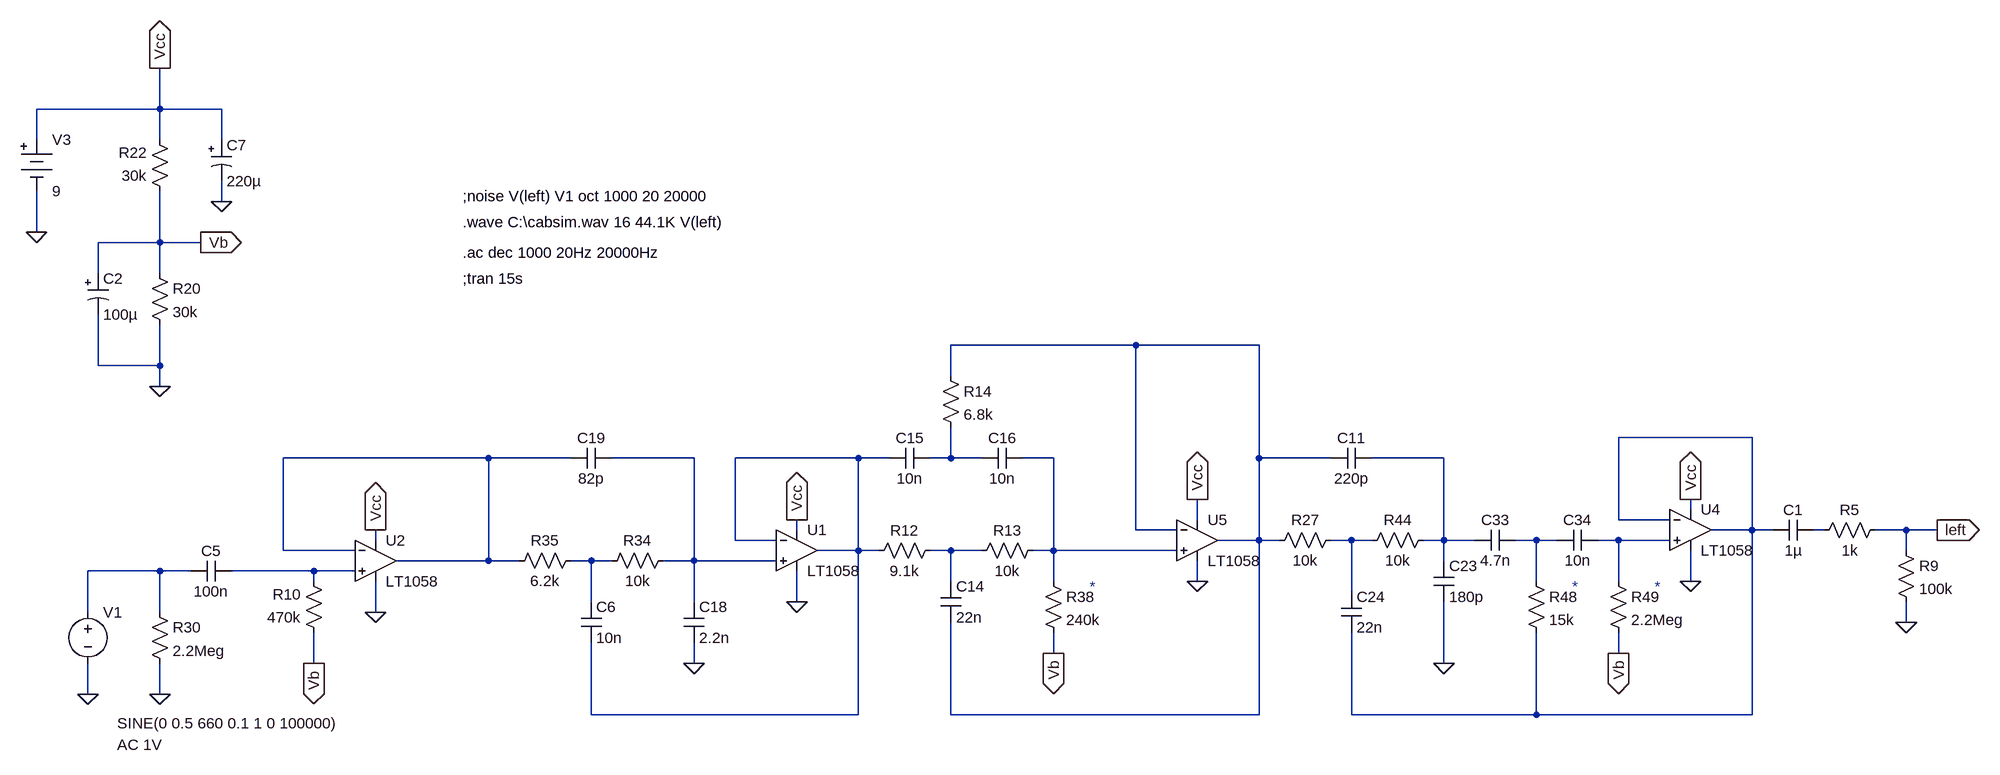
[diagram p0: schematic 4x12 V30 Cabinet Simulator lownoise.asc]
4x12 V30 Cabinet Simulator lownoise.asc, the LTspice schematic file:
Version 4
SHEET 1 2020 1684
WIRE -3840 -544 -3840 -608
WIRE -3840 -544 -4032 -544
WIRE -3744 -544 -3840 -544
WIRE -4032 -496 -4032 -544
WIRE -3840 -496 -3840 -544
WIRE -3744 -496 -3744 -544
WIRE -3744 -400 -3744 -432
WIRE -4032 -352 -4032 -416
WIRE -3840 -336 -3840 -416
WIRE -3840 -336 -3936 -336
WIRE -3776 -336 -3840 -336
WIRE -3936 -288 -3936 -336
WIRE -3840 -288 -3840 -336
WIRE -2320 -176 -2608 -176
WIRE -2128 -176 -2320 -176
WIRE -3936 -144 -3936 -224
WIRE -3840 -144 -3840 -208
WIRE -3840 -144 -3936 -144
WIRE -2608 -128 -2608 -176
WIRE -3840 -112 -3840 -144
WIRE -1360 -32 -1568 -32
WIRE -3328 0 -3648 0
WIRE -3200 0 -3328 0
WIRE -3008 0 -3136 0
WIRE -2752 0 -2944 0
WIRE -2704 0 -2752 0
WIRE -2608 0 -2608 -48
WIRE -2608 0 -2640 0
WIRE -2560 0 -2608 0
WIRE -2448 0 -2496 0
WIRE -2128 0 -2128 -176
WIRE -2016 0 -2128 0
WIRE -1840 0 -1952 0
WIRE -1456 80 -1456 64
WIRE -2224 96 -2224 64
WIRE -1568 96 -1568 -32
WIRE -1488 96 -1568 96
WIRE -2848 112 -2848 96
WIRE -2320 112 -2320 -176
WIRE -2256 112 -2320 112
WIRE -1360 112 -1360 -32
WIRE -1360 112 -1424 112
WIRE -1328 112 -1360 112
WIRE -1248 112 -1264 112
WIRE -1120 112 -1168 112
WIRE -1072 112 -1120 112
WIRE -3504 128 -3504 112
WIRE -2944 128 -2944 0
WIRE -2880 128 -2944 128
WIRE -2128 128 -2128 0
WIRE -2128 128 -2192 128
WIRE -2096 128 -2128 128
WIRE -1984 128 -2016 128
WIRE -1952 128 -1984 128
WIRE -1840 128 -1840 0
WIRE -1840 128 -1872 128
WIRE -1792 128 -1840 128
WIRE -1696 128 -1728 128
WIRE -1664 128 -1696 128
WIRE -1568 128 -1600 128
WIRE -1488 128 -1568 128
WIRE -3648 144 -3648 0
WIRE -3536 144 -3648 144
WIRE -2752 144 -2752 0
WIRE -2752 144 -2816 144
WIRE -2720 144 -2752 144
WIRE -2608 144 -2640 144
WIRE -2560 144 -2608 144
WIRE -2448 144 -2448 0
WIRE -2448 144 -2480 144
WIRE -2256 144 -2448 144
WIRE -1120 144 -1120 112
WIRE -3328 160 -3328 0
WIRE -3328 160 -3472 160
WIRE -3280 160 -3328 160
WIRE -3168 160 -3200 160
WIRE -3136 160 -3168 160
WIRE -3008 160 -3008 0
WIRE -3008 160 -3056 160
WIRE -2880 160 -3008 160
WIRE -1840 160 -1840 128
WIRE -3840 176 -3952 176
WIRE -3792 176 -3840 176
WIRE -3600 176 -3728 176
WIRE -3536 176 -3600 176
WIRE -3600 192 -3600 176
WIRE -2608 192 -2608 144
WIRE -2448 192 -2448 144
WIRE -2224 192 -2224 160
WIRE -1696 192 -1696 128
WIRE -1568 192 -1568 128
WIRE -1456 192 -1456 144
WIRE -1984 208 -1984 128
WIRE -3168 224 -3168 160
WIRE -3008 224 -3008 160
WIRE -2848 224 -2848 176
WIRE -3952 240 -3952 176
WIRE -3840 240 -3840 176
WIRE -3504 240 -3504 192
WIRE -1120 256 -1120 224
WIRE -2448 304 -2448 272
WIRE -1568 304 -1568 272
WIRE -3600 320 -3600 272
WIRE -3008 320 -3008 288
WIRE -1840 320 -1840 224
WIRE -3952 368 -3952 320
WIRE -3840 368 -3840 320
WIRE -3168 400 -3168 288
WIRE -2752 400 -2752 144
WIRE -2752 400 -3168 400
WIRE -2608 400 -2608 256
WIRE -2128 400 -2128 128
WIRE -2128 400 -2608 400
WIRE -1984 400 -1984 272
WIRE -1696 400 -1696 272
WIRE -1696 400 -1984 400
WIRE -1360 400 -1360 112
WIRE -1360 400 -1696 400
FLAG -1072 112 left
IOPIN -1072 112 Out
FLAG -4032 -352 0
FLAG -3840 -112 0
FLAG -3776 -336 Vb
IOPIN -3776 -336 Out
FLAG -3840 -608 Vcc
IOPIN -3840 -608 Out
FLAG -3952 368 0
FLAG -1840 320 0
FLAG -1456 192 0
FLAG -1456 64 Vcc
IOPIN -1456 64 Out
FLAG -1568 304 Vb
IOPIN -1568 304 Out
FLAG -2848 224 0
FLAG -2848 96 Vcc
IOPIN -2848 96 Out
FLAG -3504 240 0
FLAG -3504 112 Vcc
IOPIN -3504 112 Out
FLAG -3600 320 Vb
IOPIN -3600 320 Out
FLAG -3840 368 0
FLAG -3008 320 0
FLAG -2224 64 Vcc
IOPIN -2224 64 Out
FLAG -2224 192 0
FLAG -2448 304 Vb
IOPIN -2448 304 Out
FLAG -1120 256 0
FLAG -3744 -400 0
SYMBOL res -3856 -304 R0
SYMATTR InstName R20
SYMATTR Value 30k
SYMBOL res -3824 -400 R180
WINDOW 0 36 76 Left 2
WINDOW 3 36 40 Left 2
SYMATTR InstName R22
SYMATTR Value 30k
SYMBOL Misc\\battery -4032 -512 R0
WINDOW 123 0 0 Left 2
WINDOW 39 0 0 Left 2
SYMATTR InstName V3
SYMATTR Value 9
SYMBOL polcap -3952 -288 R0
WINDOW 3 24 64 Left 2
SYMATTR Value 100µ
SYMATTR InstName C2
SYMATTR Description Capacitor
SYMATTR Type cap
SYMATTR SpiceLine V=25 Irms=60m Rser=2.4 Lser=0
SYMBOL res -2000 112 R90
WINDOW 0 0 56 VBottom 2
WINDOW 3 32 56 VTop 2
SYMATTR InstName R27
SYMATTR Value 10k
SYMBOL cap -1952 -16 R90
WINDOW 0 0 32 VBottom 2
WINDOW 3 32 32 VTop 2
SYMATTR InstName C11
SYMATTR Value 220p
SYMBOL cap -1856 160 R0
SYMATTR InstName C23
SYMATTR Value 180p
SYMBOL res -1856 112 R90
WINDOW 0 0 56 VBottom 2
WINDOW 3 32 56 VTop 2
SYMATTR InstName R44
SYMATTR Value 10k
SYMBOL cap -2000 208 R0
SYMATTR InstName C24
SYMATTR Value 22n
SYMBOL cap -1728 112 R90
WINDOW 0 0 32 VBottom 2
WINDOW 3 32 32 VTop 2
SYMATTR InstName C33
SYMATTR Value 4.7n
SYMBOL cap -1600 112 R90
WINDOW 0 0 32 VBottom 2
WINDOW 3 32 32 VTop 2
SYMATTR InstName C34
SYMATTR Value 10n
SYMBOL res -1712 176 R0
SYMATTR InstName R48
SYMATTR Value 15k
SYMBOL res -1584 176 R0
SYMATTR InstName R49
SYMATTR Value 2.2Meg
SYMBOL cap -3728 160 R90
WINDOW 0 0 32 VBottom 2
WINDOW 3 32 32 VTop 2
SYMATTR InstName C5
SYMATTR Value 100n
SYMATTR SpiceLine V=16 Irms=0 Rser=0.007 Lser=0
SYMBOL res -2624 128 R90
WINDOW 0 0 56 VBottom 2
WINDOW 3 32 56 VTop 2
SYMATTR InstName R12
SYMATTR Value 9.1k
SYMBOL res -2464 128 R90
WINDOW 0 0 56 VBottom 2
WINDOW 3 32 56 VTop 2
SYMATTR InstName R13
SYMATTR Value 10k
SYMBOL cap -2624 192 R0
SYMATTR InstName C14
SYMATTR Value 22n
SYMBOL cap -2640 -16 R90
WINDOW 0 0 32 VBottom 2
WINDOW 3 32 32 VTop 2
SYMATTR InstName C15
SYMATTR Value 10n
SYMBOL cap -2496 -16 R90
WINDOW 0 0 32 VBottom 2
WINDOW 3 32 32 VTop 2
SYMATTR InstName C16
SYMATTR Value 10n
SYMBOL res -2624 -144 R0
SYMATTR InstName R14
SYMATTR Value 6.8k
SYMBOL res -3584 288 R180
WINDOW 0 36 76 Left 2
WINDOW 3 36 40 Left 2
SYMATTR InstName R10
SYMATTR Value 470k
SYMBOL res -3856 224 R0
SYMATTR InstName R30
SYMATTR Value 2.2Meg
SYMBOL res -3040 144 R90
WINDOW 0 0 56 VBottom 2
WINDOW 3 32 56 VTop 2
SYMATTR InstName R34
SYMATTR Value 10k
SYMBOL res -3184 144 R90
WINDOW 0 0 56 VBottom 2
WINDOW 3 32 56 VTop 2
SYMATTR InstName R35
SYMATTR Value 6.2k
SYMBOL cap -3184 224 R0
SYMATTR InstName C6
SYMATTR Value 10n
SYMBOL cap -3024 224 R0
SYMATTR InstName C18
SYMATTR Value 2.2n
SYMBOL cap -3136 -16 R90
WINDOW 0 0 32 VBottom 2
WINDOW 3 32 32 VTop 2
SYMATTR InstName C19
SYMATTR Value 82p
SYMBOL Opamps\\LT1058 -2224 64 R0
SYMATTR InstName U5
SYMBOL Opamps\\LT1058 -2848 80 R0
SYMATTR InstName U1
SYMBOL Opamps\\LT1058 -3504 96 R0
SYMATTR InstName U2
SYMBOL res -2464 176 R0
SYMATTR InstName R38
SYMATTR Value 240k
SYMBOL Opamps\\LT1058 -1456 48 R0
SYMATTR InstName U4
SYMBOL res -1136 128 R0
SYMATTR InstName R9
SYMATTR Value 100k
SYMBOL voltage -3952 224 R0
WINDOW 3 46 189 Left 2
WINDOW 123 46 223 Left 2
WINDOW 39 0 0 Left 2
SYMATTR Value SINE(0 0.5 660 0.1 1 0 100000)
SYMATTR Value2 AC 1V
SYMATTR InstName V1
SYMBOL polcap -3760 -496 R0
WINDOW 3 24 64 Left 2
SYMATTR Value 220µ
SYMATTR InstName C7
SYMATTR Description Capacitor
SYMATTR Type cap
SYMATTR SpiceLine V=2.5 Irms=1.1 Rser=0.07 Lser=0 mfg="KEMET" pn="T520B227M2R5ASE070" type="Tantalum"
SYMBOL res -1152 96 R90
WINDOW 0 0 56 VBottom 2
WINDOW 3 32 56 VTop 2
SYMATTR InstName R5
SYMATTR Value 1k
SYMBOL cap -1264 96 R90
WINDOW 0 0 32 VBottom 2
WINDOW 3 32 32 VTop 2
SYMATTR InstName C1
SYMATTR Value 1µ
SYMATTR SpiceLine V=10 Irms=0 Rser=0.009 Lser=0 mfg="TDK" pn="C1608X5RIA105K" type="X5R"
TEXT -3368 -280 Left 2 !;tran 15s
TEXT -3368 -320 Left 2 !.ac dec 1000 20Hz 20000Hz
TEXT -3368 -368 Left 2 !.wave C:\\cabsim.wav 16 44.1K V(left)
TEXT -3368 -408 Left 2 !;noise V(left) V1 oct 1000 20 20000
TEXT -1640 200 Left 2 ;*
TEXT -1512 200 Left 2 ;*
TEXT -2392 200 Left 2 ;*

The netlist it stands for:
* 4x12 V30 Cabinet Simulator lownoise.asc
R20 Vb 0 30k
R22 Vb Vcc 30k
V3 Vcc 0 9
C2 Vb 0 100µ V=25 Irms=60m Rser=2.4 Lser=0
R27 N010 N001 10k
C11 N008 N001 220p
C23 N008 0 180p
R44 N008 N010 10k
C24 N010 N002 22n
C33 N011 N008 4.7n
C34 N012 N011 10n
R48 N011 N002 15k
R49 N012 Vb 2.2Meg
C5 N016 N015 100n V=16 Irms=0 Rser=0.007 Lser=0
R12 N013 N005 9.1k
R13 N007 N013 10k
C14 N013 N001 22n
C15 N006 N005 10n
C16 N007 N006 10n
R14 N001 N006 6.8k
R10 Vb N016 470k
R30 N015 0 2.2Meg
R34 N004 N014 10k
R35 N014 N003 6.2k
C6 N014 N005 10n
C18 N004 0 2.2n
C19 N004 N003 82p
XU5 N007 N001 Vcc 0 N001 LT1057  ; LT1058, pins In+ In- V+ V- OUT
XU1 N004 N005 Vcc 0 N005 LT1057  ; LT1058, pins In+ In- V+ V- OUT
XU2 N016 N003 Vcc 0 N003 LT1057  ; LT1058, pins In+ In- V+ V- OUT
R38 N007 Vb 240k
XU4 N012 N002 Vcc 0 N002 LT1057  ; LT1058, pins In+ In- V+ V- OUT
R9 left 0 100k
V1 N015 0 SINE(0 0.5 660 0.1 1 0 100000) AC 1V
C7 Vcc 0 220µ V=2.5 Irms=1.1 Rser=0.07 Lser=0 mfg="KEMET" pn="T520B227M2R5ASE070" type="Tantalum"
R5 left N009 1k
C1 N009 N002 1µ V=10 Irms=0 Rser=0.009 Lser=0 mfg="TDK" pn="C1608X5RIA105K" type="X5R"
;tran 15s
.ac dec 1000 20Hz 20000Hz
.wave C:\cabsim.wav 16 44.1K V(left)
;noise V(left) V1 oct 1000 20 20000
* *
* *
* *
.lib LTC.lib
.backanno
.end